# Altium project ina_board_1_ver2.PrjPcb
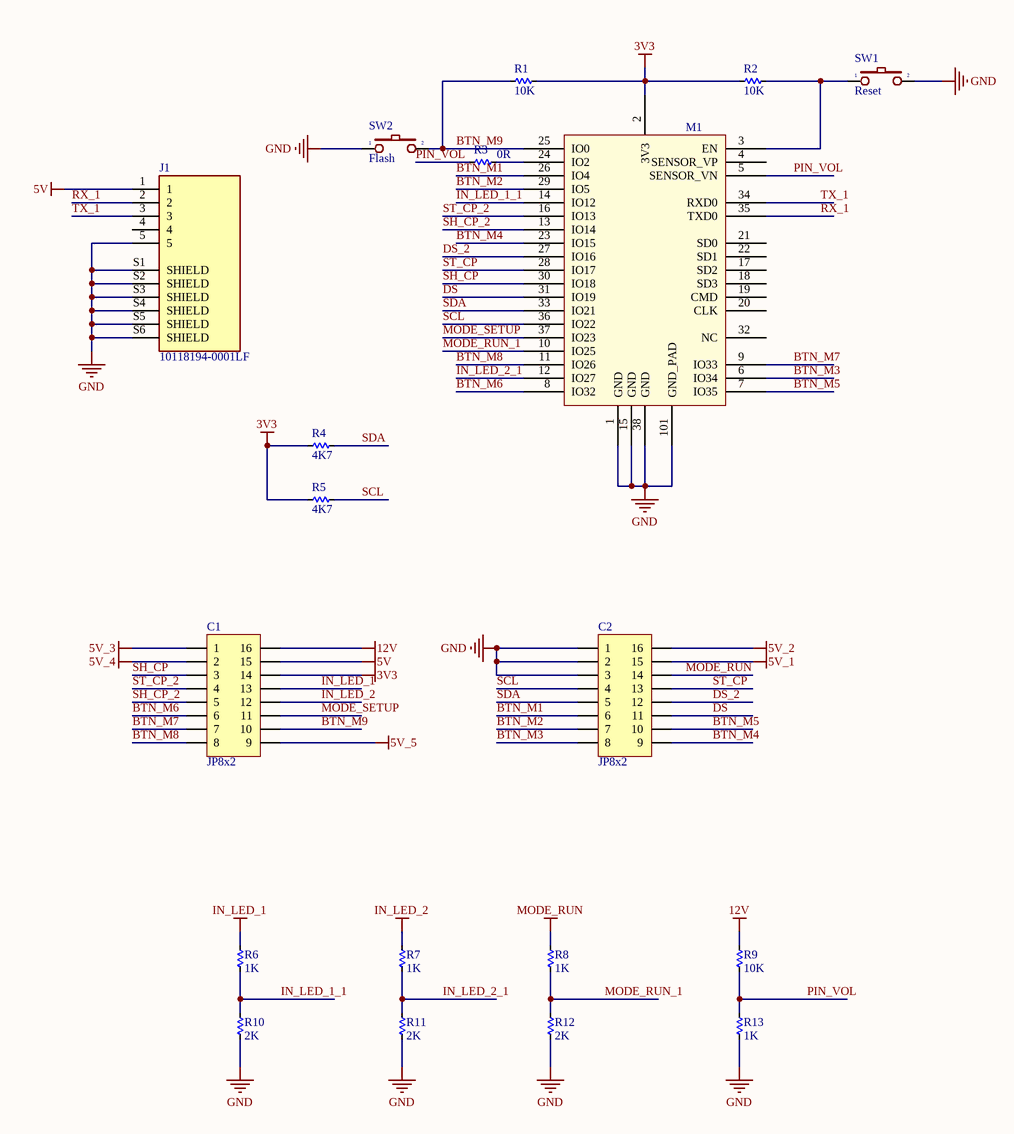
[diagram p0: esp32.SchDoc]
2 sheets, 85 parts. Net scope: global (net labels, ports and power ports of the same name join across sheets).
Board file: board_1_ver2.PcbDoc
Sheets:
  esp32.SchDoc
  power.SchDoc

## Sheet esp32.SchDoc
size A3

### Parts
C1  JP8x2  [JP8-C2T]
C2  JP8x2  [JP8-C2T]
J1  10118194-0001LF  [AMPHENOL_10118194-0001LF]
M1  ESP32S_Module  [ESP32S]  (value not drawn)
R1  10K  [RES-SMD-0603]
R2  10K  [RES-SMD-0603]
R3  0R  [RES-SMD-0603]
R4  4K7  [RES-SMD-0603]
R5  4K7  [RES-SMD-0603]
R6  1K  [RES-SMD-0603]
R7  1K  [RES-SMD-0603]
R8  1K  [RES-SMD-0603]
R9  10K  [RES-SMD-0603]
R10  2K  [RES-SMD-0603]
R11  2K  [RES-SMD-0603]
R12  2K  [RES-SMD-0603]
R13  1K  [RES-SMD-0603]
SW1  Reset  [SW1-SMD]
SW2  Flash  [SW-DIP1-1]

### Nets
3V3: C1.14 M1.2(3V3) R1.1 R2.2 R4.1 R5.1
5V: C1.15 J1.1
5V_1: C2.15
5V_2: C2.16
5V_3: C1.1
5V_4: C1.2
5V_5: C1.9
12V: C1.16 R9.2
GND: C2.1 C2.2 C2.3 J1.5 J1.S1(SHIELD) J1.S2(SHIELD) J1.S3(SHIELD) J1.S4(SHIELD) J1.S5(SHIELD) J1.S6(SHIELD) M1.1(GND) M1.15(GND) M1.38(GND) M1.101(GND_PAD) R10.1 R11.1 R12.1 R13.1 SW1.2 SW2.1
IN_LED_1: C1.13 R6.2
IN_LED_2: C1.12 R7.2
MODE_RUN: C2.14 R8.2
BTN_M1: C2.6 M1.26(IO4)
BTN_M2: C2.7 M1.29(IO5)
BTN_M3: C2.8 M1.6(IO34)
BTN_M4: C2.9 M1.23(IO15)
BTN_M5: C2.10 M1.7(IO35)
BTN_M6: C1.6 M1.8(IO32)
BTN_M7: C1.7 M1.9(IO33)
BTN_M8: C1.8 M1.11(IO26)
BTN_M9: C1.10 M1.25(IO0) R1.2 SW2.2
DS: C2.11 M1.31(IO19)
DS_2: C2.12 M1.27(IO16)
IN_LED_1_1: M1.14(IO12) R6.1 R10.2
IN_LED_2_1: M1.12(IO27) R7.1 R11.2
MODE_RUN_1: M1.10(IO25) R8.1 R12.2
MODE_SETUP: C1.11 M1.37(IO23)
PIN_VOL: M1.5(SENSOR_VN) R3.1 R9.1 R13.2
RX_1: J1.2 M1.35(TXD0)
SCL: C2.4 M1.36(IO22) R5.2
SDA: C2.5 M1.33(IO21) R4.2
SH_CP: C1.3 M1.30(IO18)
SH_CP_2: C1.5 M1.13(IO14)
ST_CP: C2.13 M1.28(IO17)
ST_CP_2: C1.4 M1.16(IO13)
TX_1: J1.3 M1.34(RXD0)
NetM1_3: M1.3(EN) R2.1 SW1.1
NetM1_24: M1.24(IO2) R3.2

Not connected (* = marked no-connect by the designer): J1 4; M1 4(SENSOR_VP) 17(SD2) 18(SD3) 19(CMD) 20(CLK) 21(SD0) 22(SD1) 32(NC)

### Library data of the parts
C1 C2 = JP8x2: WR-PHD 2.54 mm Dual Socket Header; Manufacturer: W¨¹rth Elektronik eiSos GmbH; partNo: 61301621821; ComponentLink1 Description: Manufacturer; ComponentLink2 Description: Datasheet; NoPins: 16; Created Date: 29 March 2013; ComponentLink1URL: http://www.we-online.com; ComponentLink2URL: http://katalog.we-online.de/em/datasheet/6130xx21821.pdf; Created by: Karrer Zheng
J1 = 10118194-0001LF: USB - micro B USB 2.0 Receptacle Connector 5 Position Surface Mount, Right Angle; Through Hole; MF: Amphenol ICC; Package: None; Price: None; Availability: Unavailable; MP: 10118194-0001LF; SnapEDA_Link: https://www.snapeda.com/parts/10118194-0001LF/Amphenol%20FCI/view-part/1413308/?ref=snap; Value: *
M1 = ESP32S_Module: Esp-32S; Datasheet: https://espressif.com/sites/default/files/documentation/esp_wroom_32_datasheet_en.pdf
R1-R13 = Res-SMD: Resistor; Manufacturer: Generic Components; Class: Passive; Published: 08/06/2000; Publisher: Altium Hobart Technology Centre
SW1 SW2 = SW2: Switch button 2 pin; Value: SW chip 2 pin

## Sheet power.SchDoc
size A3
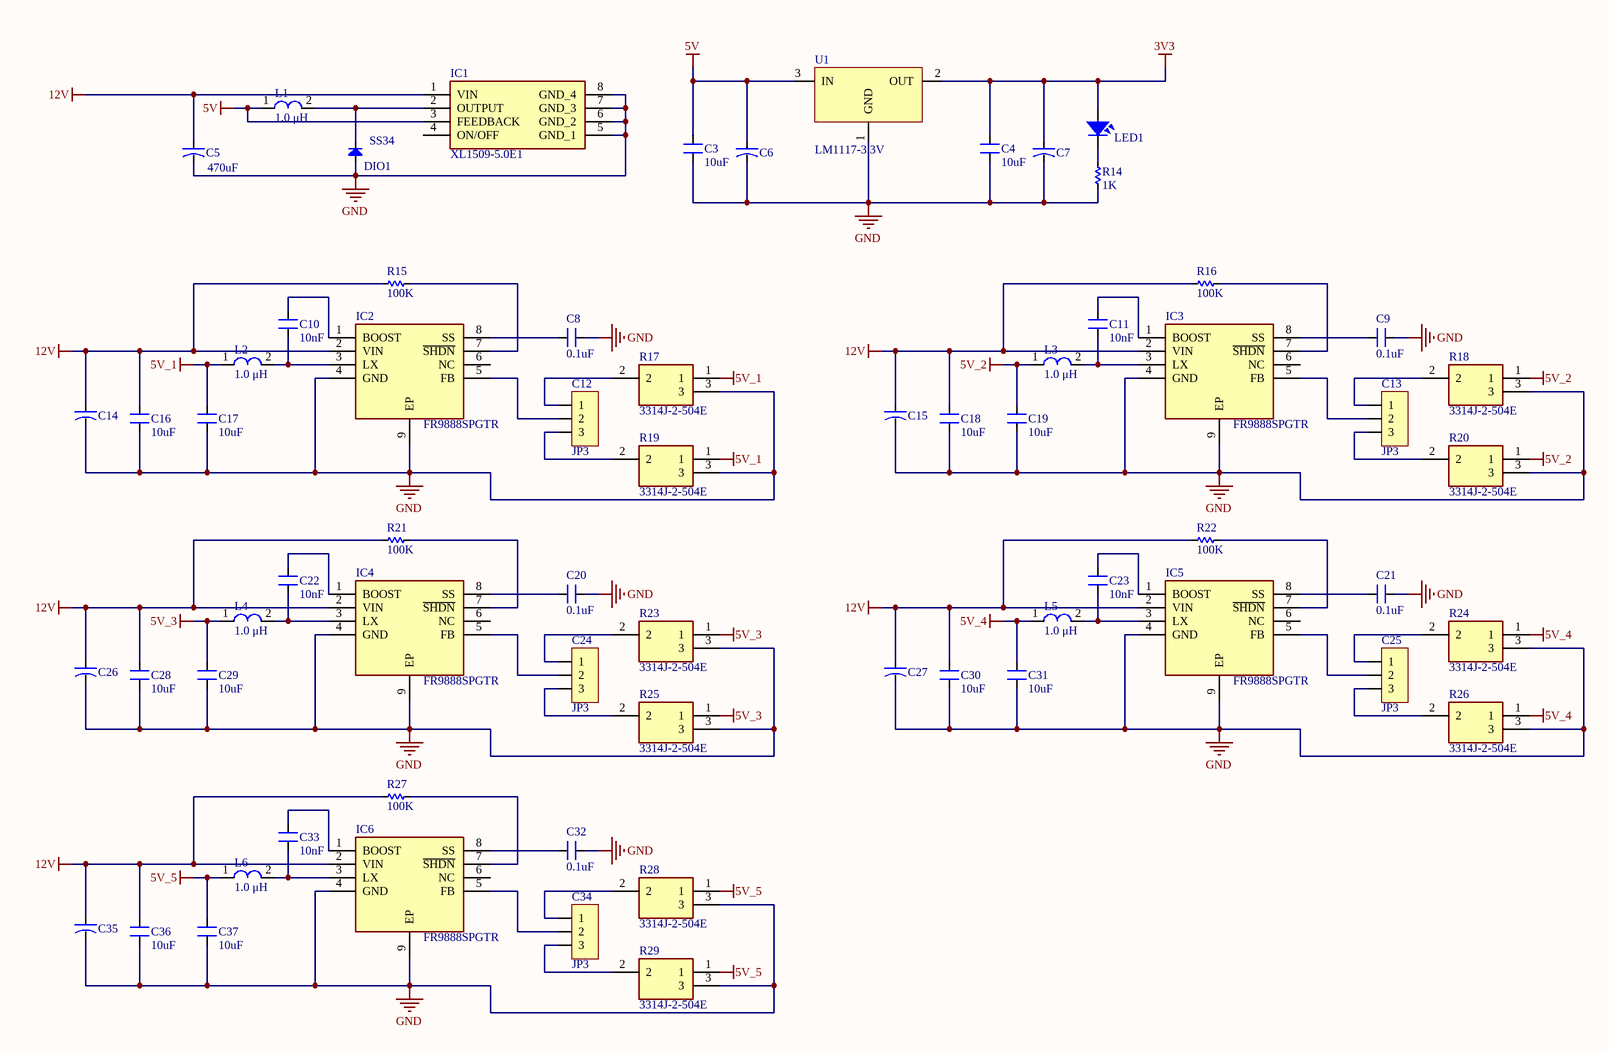
[diagram p1: power.SchDoc]

### Parts
C3  10uF  [CN-SMD-0603]
C4  10uF  [CN-SMD-0603]
C5  470uF  [CAP-ALU-SMD-6.3x7.7x2.2]
C6  CN-ALU-SMD  [CAP-ALU-SMD-4.5x5x1.4]  (value not drawn)
C7  CN-ALU-SMD  [CAP-ALU-SMD-4.5x5x1.4]  (value not drawn)
C8  0.1uF  [CN-SMD-0603]
C9  0.1uF  [CN-SMD-0603]
C10  10nF  [CN-SMD-0603]
C11  10nF  [CN-SMD-0603]
C12  JP3  [JP3-D1T]
C13  JP3  [JP3-D1T]
C14  CN-ALU-SMD  [CAP-ALU-SMD-4.5x5x1.4]  (value not drawn)
C15  CN-ALU-SMD  [CAP-ALU-SMD-4.5x5x1.4]  (value not drawn)
C16  10uF  [CN-SMD-0603]
C17  10uF  [CN-SMD-0603]
C18  10uF  [CN-SMD-0603]
C19  10uF  [CN-SMD-0603]
C20  0.1uF  [CN-SMD-0603]
C21  0.1uF  [CN-SMD-0603]
C22  10nF  [CN-SMD-0603]
C23  10nF  [CN-SMD-0603]
C24  JP3  [JP3-D1T]
C25  JP3  [JP3-D1T]
C26  CN-ALU-SMD  [CAP-ALU-SMD-4.5x5x1.4]  (value not drawn)
C27  CN-ALU-SMD  [CAP-ALU-SMD-4.5x5x1.4]  (value not drawn)
C28  10uF  [CN-SMD-0603]
C29  10uF  [CN-SMD-0603]
C30  10uF  [CN-SMD-0603]
C31  10uF  [CN-SMD-0603]
C32  0.1uF  [CN-SMD-0603]
C33  10nF  [CN-SMD-0603]
C34  JP3  [JP3-D1T]
C35  CN-ALU-SMD  [CAP-ALU-SMD-4.5x5x1.4]  (value not drawn)
C36  10uF  [CN-SMD-0603]
C37  10uF  [CN-SMD-0603]
DIO1  SS34  [DIO-SMD-106]
IC1  XL1509-5.0E1  [SOIC127P600X175-8N]
IC2  FR9888SPGTR  [SOIC127P600X170-9N]
IC3  FR9888SPGTR  [SOIC127P600X170-9N]
IC4  FR9888SPGTR  [SOIC127P600X170-9N]
IC5  FR9888SPGTR  [SOIC127P600X170-9N]
IC6  FR9888SPGTR  [SOIC127P600X170-9N]
L1  1.0 μH  [L-SMD-M-7.3x4.5]
L2  1.0 μH  [L-SMD-M-7.3x4.5]
L3  1.0 μH  [L-SMD-M-7.3x4.5]
L4  1.0 μH  [L-SMD-M-7.3x4.5]
L5  1.0 μH  [L-SMD-M-7.3x4.5]
L6  1.0 μH  [L-SMD-M-7.3x4.5]
LED1  LED  [LED-0805-Blue]  (value not drawn)
R14  1K  [RES-SMD-0603]
R15  100K  [RES-SMD-0603]
R16  100K  [RES-SMD-0603]
R17  3314J-2-504E  [3314J-1]
R18  3314J-2-504E  [3314J-1]
R19  3314J-2-504E  [3314J-1]
R20  3314J-2-504E  [3314J-1]
R21  100K  [RES-SMD-0603]
R22  100K  [RES-SMD-0603]
R23  3314J-2-504E  [3314J-1]
R24  3314J-2-504E  [3314J-1]
R25  3314J-2-504E  [3314J-1]
R26  3314J-2-504E  [3314J-1]
R27  100K  [RES-SMD-0603]
R28  3314J-2-504E  [3314J-1]
R29  3314J-2-504E  [3314J-1]
U1  LM1117-3.3V  [SOT223]

### Nets
3V3: C4.1 C7.1 LED1.1 U1.2(OUT)
5V: C3.1 C6.1 IC1.3(FEEDBACK) L1.1 U1.3(IN)
5V_1: C17.1 L2.1 R17.1 R19.1
5V_2: C19.1 L3.1 R18.1 R20.1
5V_3: C29.1 L4.1 R23.1 R25.1
5V_4: C31.1 L5.1 R24.1 R26.1
5V_5: C37.1 L6.1 R28.1 R29.1
12V: C5.1 C14.1 C15.1 C16.1 C18.1 C26.1 C27.1 C28.1 C30.1 C35.1 C36.1 IC1.1(VIN) IC2.2(VIN) IC3.2(VIN) IC4.2(VIN) IC5.2(VIN) IC6.2(VIN) R15.1 R16.1 R21.1 R22.1 R27.1
GND: C3.2 C4.2 C5.2 C6.2 C7.2 C8.1 C9.1 C14.2 C15.2 C16.2 C17.2 C18.2 C19.2 C20.1 C21.1 C26.2 C27.2 C28.2 C29.2 C30.2 C31.2 C32.1 C35.2 C36.2 C37.2 DIO1.1(A) IC1.5(GND_1) IC1.6(GND_2) IC1.7(GND_3) IC1.8(GND_4) IC2.4(GND) IC2.9(EP) IC3.4(GND) IC3.9(EP) IC4.4(GND) IC4.9(EP) IC5.4(GND) IC5.9(EP) IC6.4(GND) IC6.9(EP) R14.2 R17.3 R18.3 R19.3 R20.3 R23.3 R24.3 R25.3 R26.3 R28.3 R29.3 U1.1(GND)
NetC8_2: C8.2 IC2.8(SS)
NetC9_2: C9.2 IC3.8(SS)
NetC10_1: C10.1 IC2.3(LX) L2.2
NetC10_2: C10.2 IC2.1(BOOST)
NetC11_1: C11.1 IC3.3(LX) L3.2
NetC11_2: C11.2 IC3.1(BOOST)
NetC12_1: C12.1 R17.2
NetC12_2: C12.2 IC2.5(FB)
NetC12_3: C12.3 R19.2
NetC13_1: C13.1 R18.2
NetC13_2: C13.2 IC3.5(FB)
NetC13_3: C13.3 R20.2
NetC20_2: C20.2 IC4.8(SS)
NetC21_2: C21.2 IC5.8(SS)
NetC22_1: C22.1 IC4.3(LX) L4.2
NetC22_2: C22.2 IC4.1(BOOST)
NetC23_1: C23.1 IC5.3(LX) L5.2
NetC23_2: C23.2 IC5.1(BOOST)
NetC24_1: C24.1 R23.2
NetC24_2: C24.2 IC4.5(FB)
NetC24_3: C24.3 R25.2
NetC25_1: C25.1 R24.2
NetC25_2: C25.2 IC5.5(FB)
NetC25_3: C25.3 R26.2
NetC32_2: C32.2 IC6.8(SS)
NetC33_1: C33.1 IC6.3(LX) L6.2
NetC33_2: C33.2 IC6.1(BOOST)
NetC34_1: C34.1 R28.2
NetC34_2: C34.2 IC6.5(FB)
NetC34_3: C34.3 R29.2
NetDIO1_2: DIO1.2(K) IC1.2(OUTPUT) L1.2
NetIC2_7: IC2.7(~{SHDN}) R15.2
NetIC3_7: IC3.7(~{SHDN}) R16.2
NetIC4_7: IC4.7(~{SHDN}) R21.2
NetIC5_7: IC5.7(~{SHDN}) R22.2
NetIC6_7: IC6.7(~{SHDN}) R27.2
NetLED1_2: LED1.2 R14.1

Not connected (* = marked no-connect by the designer): IC1 4(ON/OFF); IC2 6(NC); IC3 6(NC); IC4 6(NC); IC5 6(NC); IC6 6(NC)

### Library data of the parts
C3 C4 C8-C11 C16-C23 C28-C33 C36 C37 = CN: Tu gom; Value: 33pF
C5-C7 C14 C15 C26 C27 C35 = CN-ALU-SMD: Polarized Capacitor (Axial); Published: 8-Jun-2000; LatestRevisionDate: 17-Jul-2002; LatestRevisionNote: Re-released for DXP Platform.; PackageReference: POLAR0.8; Publisher: Altium Limited
C12 C13 C24 C25 C34 = JP3: WR-PHD 2.54 mm Angled Socket Header; Manufacturer: W¨¹rth Elektronik eiSos GmbH; partNo: 613003143121; ComponentLink1 Description: Manufacturer; ComponentLink2 Description: Datasheet; NoPins: 03; Created Date: 29 March 2013; ComponentLink1URL: http://www.we-online.com; ComponentLink2URL: http://katalog.we-online.de/em/datasheet/6130xx143121.pdf; Created by: Karrer Zheng
DIO1 = Diode SMD: Default Diode; Code - JEDEC: DO-214-AB; Value: 1N5007; Published: 8-Jun-2000; Revision: July-2002: Re-released for DXP Platform.; Publisher: Altium Limited
IC1 = XL1509-5.0E1: Integrated Circuit; Manufacturer_Name: XLSEMI; Datasheet Link: https://datasheet.lcsc.com/szlcsc/XLSEMI-XL1509-5-0E1_C61063.pdf; Height: 1.75mm; Manufacturer_Part_Number: XL1509-5.0E1
IC2-IC6 = FR9888SPGTR: Integrated Circuit; Manufacturer_Name: Fitipower; Datasheet Link: https://datasheet.lcsc.com/szlcsc/Fitipower-Integrated-Tech-FR9888SPGTR_C80507.pdf; Height: 1.7mm; Manufacturer_Part_Number: FR9888SPGTR
L1-L6 = L-SMD-1: partNo: 78477010; Manufacturer: Wurth Elektronik; Inductance: 1.0 μH; ComponentLink1Description: Manufacturer; ComponentLink1URL: http://www.we-online.de; Created by: Baojun Chen; Created Date: Nov.2015; ComponentLink2Description: Datasheet; ComponentLink2URL: http://katalog.we-online.de/pbs/datasheet/78477010.pdf
LED1 = LED SMD: Value: LED 3 - 5 ly 2 Colour
R14-R16 R21 R22 R27 = Res-SMD: as R1 on sheet esp32; Published: 08/06/2000; Publisher: Altium Hobart Technology Centre
R17-R20 R23-R26 R28 R29 = 3314J-2-504E: Resistor; Manufacturer_Name: Bourns; Datasheet Link: http://www.bourns.com/docs/Product-Datasheets/3314.pdf; Manufacturer_Part_Number: 3314J-2-504E; Mouser Part Number: 652-3314J-2-504E; Mouser Price/Stock: https://www.mouser.co.uk/ProductDetail/Bourns/3314J-2-504E?qs=QXsCy0sQn1B1cVm1aQFSNQ%3D%3D; Arrow Part Number: 3314J-2-504E; Arrow Price/Stock: https://www.arrow.com/en/products/3314j-2-504e/bourns
U1 = LM1117: 800mA Low-Dropout Linear Regulator; Creator: Nguyen Ba Bien; Website: http://group3i.net

## Nets that join several sheets
3V3: esp32 (6 pins), power (C4.1 C7.1 LED1.1 U1.2)
5V: esp32 (C1.15 J1.1), power (5 pins)
5V_1: esp32 (C2.15), power (C17.1 L2.1 R17.1 R19.1)
5V_2: esp32 (C2.16), power (C19.1 L3.1 R18.1 R20.1)
5V_3: esp32 (C1.1), power (C29.1 L4.1 R23.1 R25.1)
5V_4: esp32 (C1.2), power (C31.1 L5.1 R24.1 R26.1)
5V_5: esp32 (C1.9), power (C37.1 L6.1 R28.1 R29.1)
12V: esp32 (C1.16 R9.2), power (22 pins)
GND: esp32 (20 pins), power (52 pins)